# Altium schematic sheet MosFetsDrive_2.SchDoc
size A4; SheetNumber: 4; SheetTotal: 6
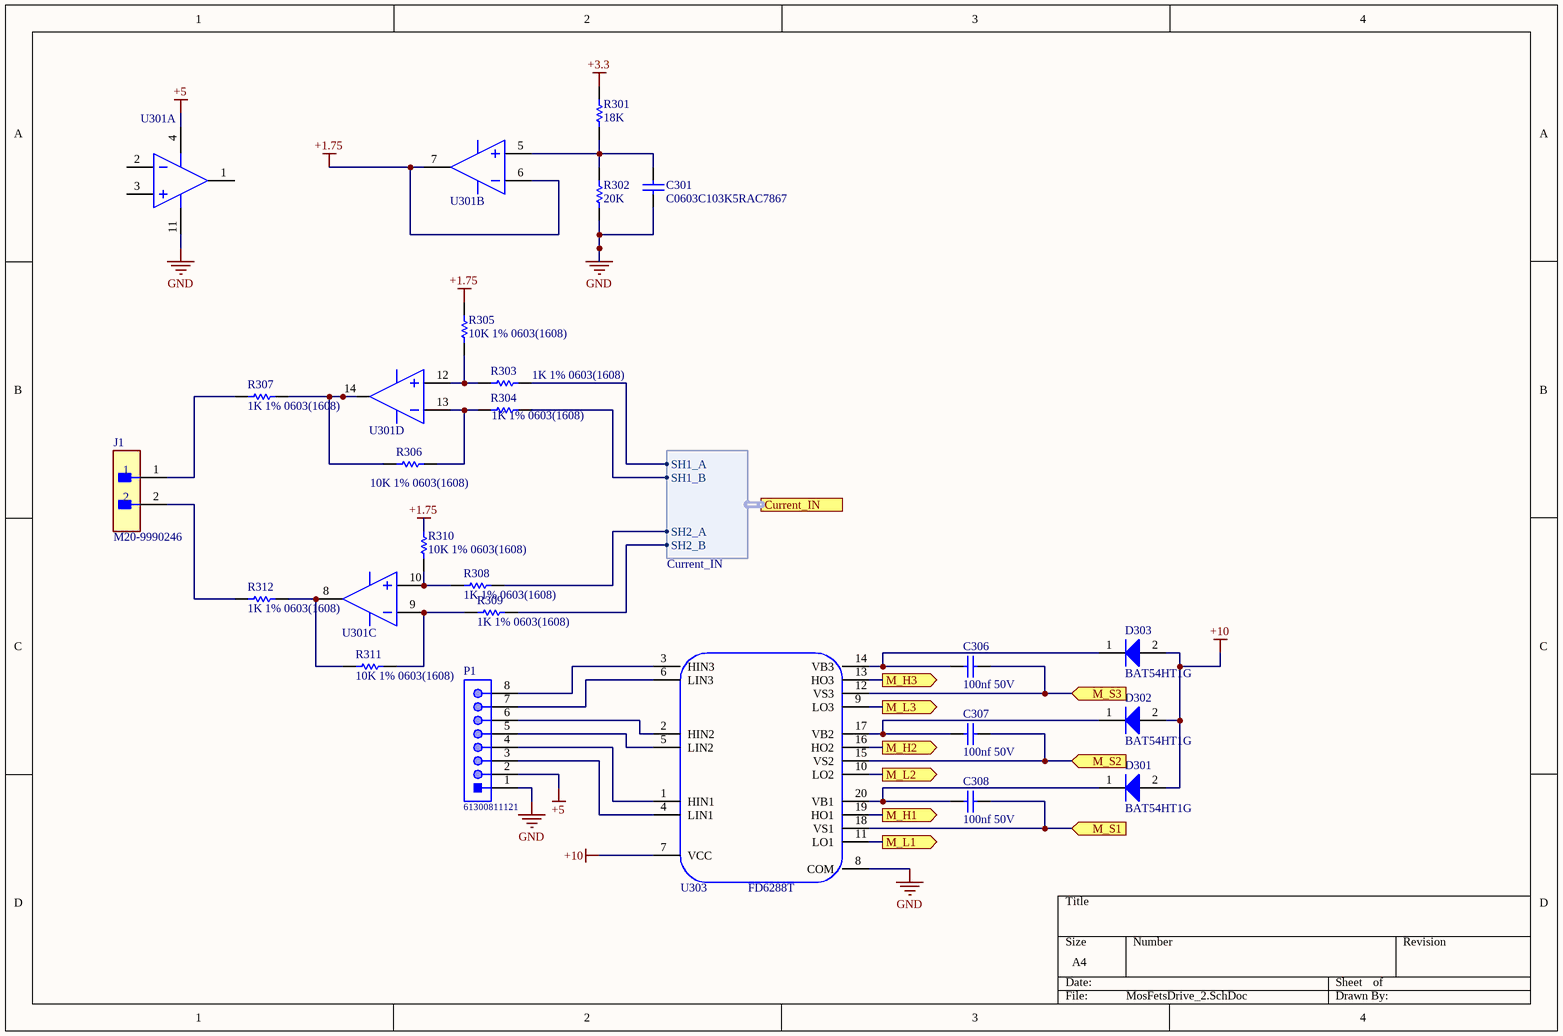
[diagram p0: MosFetsDrive_2.SchDoc]

## Parts
C301  C0603C103K5RAC7867  [CAPC1608X87X35ML15T15]
C306  100nf 50V  [CAPC1608X90X35LL15T15]
C307  100nf 50V  [CAPC1608X90X35LL15T15]
C308  100nf 50V  [CAPC1608X90X35LL15T15]
D301  BAT54HT1G  [ONSC-SOD-323-2-477-02_V]
D302  BAT54HT1G  [ONSC-SOD-323-2-477-02_V]
D303  BAT54HT1G  [ONSC-SOD-323-2-477-02_V]
J1  M20-9990246  [FP-M20-9990246-MFG]
P1  61300811121  [61300811121]
R301  18K  [RESC1608X55X30LL20T20]
R302  20K  [RESC1608X55X30LL20T20]
R303  1K 1% 0603(1608)  [RESC0603(1608)_N]
R304  1K 1% 0603(1608)  [RESC0603(1608)_N]
R305  10K 1% 0603(1608)  [RESC0603(1608)_N]
R306  10K 1% 0603(1608)  [RESC0603(1608)_N]
R307  1K 1% 0603(1608)  [RESC0603(1608)_N]
R308  1K 1% 0603(1608)  [RESC0603(1608)_N]
R309  1K 1% 0603(1608)  [RESC0603(1608)_N]
R310  10K 1% 0603(1608)  [RESC0603(1608)_N]
R311  10K 1% 0603(1608)  [RESC0603(1608)_N]
R312  1K 1% 0603(1608)  [RESC0603(1608)_N]
U301  (no value)  [SOP-14_L8.6-W3.9-P1.27-LS6.0-BL]  (parts A,B,C,D of 4)
U303  FD6288T  [TSSOP-20_L6.5-W4.4-P0.65-LS6.4-BL]

## Ports
Current_IN (harness Current_IN), M_H1 (out), M_H2 (out), M_H3 (out), M_L1 (out), M_L2 (out), M_L3 (out), M_S1 (in), M_S2 (in), M_S3 (in)

## Harnesses
Current_IN: SH1_A, SH1_B, SH2_A, SH2_B

## Nets
+1.75: R305.2 R310.2 U301.6(2IN-) U301.7(2OUT)
+3.3: R301.2
+5: P1.2 U301.4(VCC)
+10: D301.2(A) D302.2(A) D303.2(A) U303.7(VCC)
GND: C301.1 P1.1 R302.1 U301.11(GND) U303.8(COM)
M_H1: U303.19(HO1) ; port M_H1
M_H2: U303.16(HO2) ; port M_H2
M_H3: U303.13(HO3) ; port M_H3
M_L1: U303.11(LO1) ; port M_L1
M_L2: U303.10(LO2) ; port M_L2
M_L3: U303.9(LO3) ; port M_L3
M_S1: C308.2 U303.18(VS1) ; port M_S1
M_S2: C307.2 U303.15(VS2) ; port M_S2
M_S3: C306.2 U303.12(VS3) ; port M_S3
NetC301_2: C301.2 R301.1 R302.2 U301.5(2IN+)
NetC306_1: C306.1 D303.1(K) U303.14(VB3)
NetC307_1: C307.1 D302.1(K) U303.17(VB2)
NetC308_1: C308.1 D301.1(K) U303.20(VB1)
NetJ1_1: J1.1 R307.1
NetJ1_2: J1.2 R312.1
NetP1_3: P1.3 U303.4(LIN1)
NetP1_4: P1.4 U303.1(HIN1)
NetP1_5: P1.5 U303.5(LIN2)
NetP1_6: P1.6 U303.2(HIN2)
NetP1_7: P1.7 U303.6(LIN3)
NetP1_8: P1.8 U303.3(HIN3)
NetR303_1: R303.1 R305.1 U301.12(4IN+)
NetR303_2: R303.2 ; port Current_IN.SH1_A
NetR304_1: R304.1 R306.2 U301.13(4IN-)
NetR304_2: R304.2 ; port Current_IN.SH1_B
NetR306_1: R306.1 R307.2 U301.14(4OUT)
NetR308_1: R308.1 R310.1 U301.10(3IN+)
NetR308_2: R308.2 ; port Current_IN.SH2_A
NetR309_1: R309.1 R311.2 U301.9(3IN-)
NetR309_2: R309.2 ; port Current_IN.SH2_B
NetR311_1: R311.1 R312.2 U301.8(3OUT)

Not connected (* = marked no-connect by the designer): U301 1(1OUT) 2(1IN-) 3(1IN+)

## Library data of the parts
C301 = CMP-2006-03046-1: Manufacturer: Kemet; Part Number: C0603C103K5RAC7867
C306-C308 = CMP-2006-04378-1: Manufacturer: AVX Interconnect / Elco; Part Number: 06035C102KAT2A
D301-D303 = CMP-1055-00462-1: Schottky Barrier Diode, 2-Pin SOD-323, Pb-Free, Tape and Reel; Manufacturer: On Semiconductor; Configuration: Single; trr Max (ns): 5; IFSM Max (A): 0.6; ComponentLink3URL: http://www.onsemi.com/pub_link/Collateral/477-02.PDF.1; PackageDescription: 2-Pin SOD, Body 1.7 x 1.25 mm; ComponentLink2URL: http://www.onsemi.cn/pub_link/Collateral/BAT54HT1-D.PDF; ComponentLink3Description: Package Specification; ComponentLink2Description: Datasheet; DatasheetVersion: Rev. 6; PackageReference: SOD-323-2-477-02; RoHS: TRUE; ComponentLink1URL: http://www.onsemi.com/; Packing: Tape and Reel; PartNumber: BAT54HT1G; Mounting Technology: Surface Mount; ComponentLink1Description: Manufacturer URL; PackageVersion: Rev. H, 03/2007
J1 = CMP-15831-000009-1: CONN HEADER VERT 2POS 2.54MM; Manufacturer: Harwin; Conn Gender: Male; Conn Orientation: Vertical; Number Of Contacts: 2; Current Rating: 3A; ComponentLink2URL: https://cdn.harwin.com/pdfs/M20-999.pdf; ComponentLink2Description: Datasheet; Package: M20-9990246; Temperature: -40°C to +105°C; Octopart: https://octopart.com/m20-9990246-harwin-2590635; Mouser Description: 2.54mm (0.1") Pitch SIL Vertical PC Tail Pin Header, 6.1mm mating pin height, tin, 2 contacts; Temperature Range High: +105°C; Device Class L1: Connectors; RoHS: TRUE; Automotive: No; Height: 8.99mm; Number Of Rows: 1; Contact Material: Tin,Nickel; Category: Conn; Pitch: 2.54mm; Lead Free: Yes; Digikey Description: CONN HEADER VERT 2POS 2.54MM; Manufacturer Part Number: M20-9990246; Temperature Range Low: -40°C; Device Class L3: unset; Device Class L2: Headers and Wire Housings
P1 = CMP-1502-01076-1: THT Vertical Pin Header WR-PHD, Pitch 2.54 mm, Single Row, 8 pins; Manufacturer: Wurth Elektronik; Rated Current: 3A; Pin Number: 8; Working Voltage: 250VAC; Gender: Male; Contact Resistance: 20mOhm; Pitch: 2.54mm; Withstanding Voltage: 500VAC; Publisher: WurthElektronik; Operating Temperature: -40to105degC; Orientation: Vertical; Row Number: Single; Part Number: 61300811121; Package Reference: 61300811121; Mounting Technology: THT; Packaging: Bag; Manufacturer URL: http://www.we-online.de; Datasheet URL: https://katalog.we-online.de/em/datasheet/6130xx11121.pdf
R301 R302 = CMP-2000-00873-1: Manufacturer: Panasonic; Part Number: ERA3AEB102V
R303-R312 = CMP-1012-00623-1: 10K 0.1W 1% 0603 (1608 Metric)  SMD; Value: 10000.00 Ohm; Case-EIA: 0603; Case-Metric: 1608; Power: 0.1 W; Tolerance: 1 %; Technology: SMT
U301 = LMV324: Manufacturer: IDCHIP(英锐芯); Add into BOM: yes; Symbol: LMV324; Device: LMV324; LCSC Part Name: LMV324; Supplier Part: C395458; Manufacturer Part: LMV324; Supplier Footprint: SOP-14; JLCPCB Part Class: Extended Part; Datasheet: https://atta.szlcsc.com/upload/public/pdf/source/20190621/C395458_73BC997AE56D73F633AABC289F159708.pdf; Supplier: LCSC; Convert to PCB: yes; Amplifier Type: -; Number of Circuits: -; -3db Bandwidth（G=1）: -; Current - Input Bias（Ib）: -; Voltage - Input Offset（Vos）: -; Gain Bandwidth Product（GBP）: -; Slew Rate（SR）: -; Output Type: -; Supply Voltage（Single）: -; Iq per channel (Typ): -; Operating Temperature: -
U303 = FD6288T: Manufacturer: Fortior Tech(峰岹); Symbol: FD6288; Add into BOM: yes; Device: FD6288T; LCSC Part Name: FD6288T; Supplier Part: C97683; Manufacturer Part: FD6288T; Supplier Footprint: TSSOP-20; JLCPCB Part Class: Extended Part; Datasheet: https://atta.szlcsc.com/upload/public/pdf/source/20180912/C97683_ECE58C9DF7F061C95E95DF4276B152DC.pdf; Supplier: LCSC; Convert to PCB: yes